# EAGLE design MIDI board (EAGLE 9.0.0)
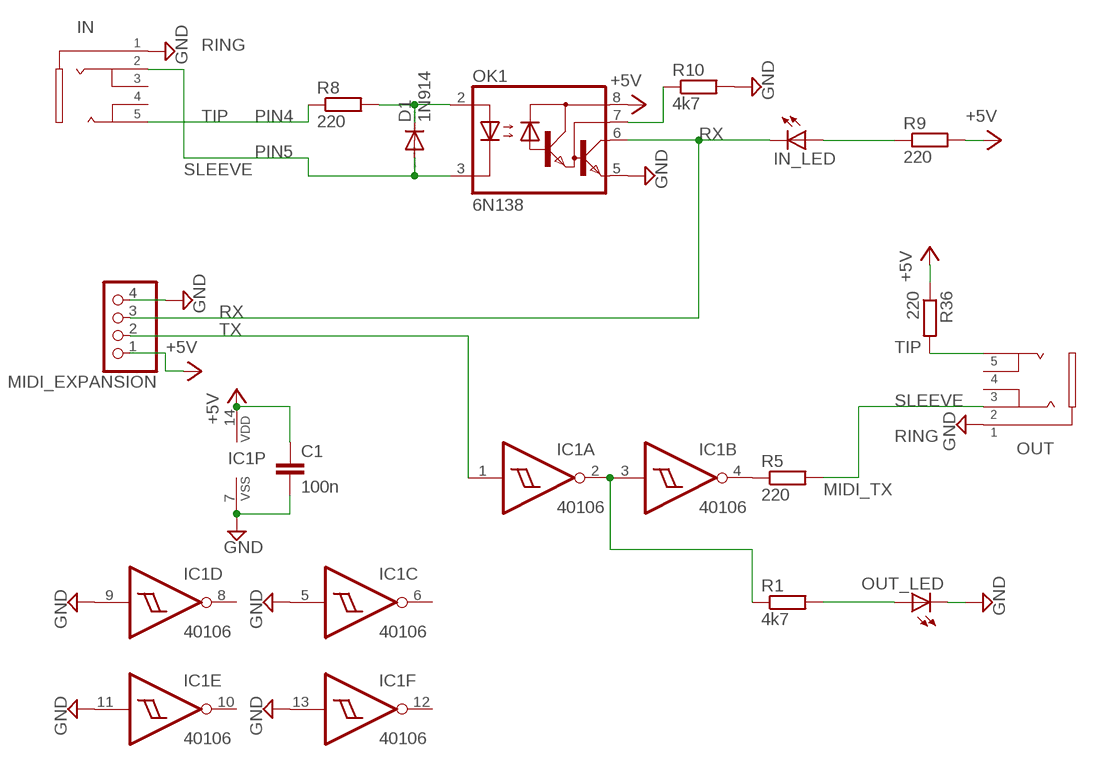
[diagram p0: schematic, sheet 1]

## Parts
C1  100n  C-EU050-025X075  [C050-025X075]
D1  1N914  [D-6.35]
IC1  40106  40106N  [DIL14]
IN  PJ-324MH  [PJ-324MH]
IN_LED  LED3MM-NB  [LED3MM]
MIDI_EXPANSION  PINHD-1X4  [1X04]
OK1  6N138  [DIL08]
OUT  PJ-324MH  [PJ-324MH]
OUT_LED  LED3MM-NB  [LED3MM]
R1  4k7  BOX-RESISTOR  [0204/7]
R5  220  BOX-RESISTOR  [0204/7]
R8  220  BOX-RESISTOR  [0204/7]
R9  220  BOX-RESISTOR  [0204/7]
R10  4k7  BOX-RESISTOR  [0204/7]
R36  220  BOX-RESISTOR  [0204/7]

## Nets
+5V [power]: C1.1 IC1.14(P:VDD) MIDI_EXPANSION.1 OK1.8(VCC) R9.2 R36.1
GND: C1.2 IC1.5(C:I) IC1.7(P:VSS) IC1.9(D:I) IC1.11(E:I) IC1.13(F:I) IN.1 MIDI_EXPANSION.4 OK1.5(GND) OUT.1 OUT_LED.K(C) R10.2
MIDI_TX: OUT.2 R5.2
N$2: OUT_LED.A R1.2
N$16: IN_LED.A R9.1
N$43: IC1.2(A:O) IC1.3(B:I) R1.1
N$44: IC1.4(B:O) R5.1
N$45: OUT.5 R36.2
N$52: OK1.7(VB) R10.1
N$53: D1.C OK1.2(A) R8.2
PIN4: IN.5 R8.1
PIN5: D1.A IN.2 OK1.3(C)
RX: IN_LED.K(C) MIDI_EXPANSION.3 OK1.6(VO)
TX: IC1.1(A:I) MIDI_EXPANSION.2
Unconnected: IC1.6(C:O) IC1.8(D:O) IC1.10(E:O) IC1.12(F:O) IN.3 IN.4 OUT.3 OUT.4

## Notes on the sheet
- RING
- TIP
- SLEEVE
- TIP
- SLEEVE
- RING

## Library data of the parts
C1 = rcl:C-EU: CAPACITOR, European symbol; SPICEPREFIX: C
D1 = toggle-nb:1N914
IC1 = 40xx:40106: Hex SCHMITT TRIGGER
IN OUT = audio-jacks:PJ-324M
IN_LED OUT_LED = toggle-nb:LED3MM-NB
MIDI_EXPANSION = pinhead:PINHD-1X4: PIN HEADER
OK1 = optocoupler:6N138: MOTOROLA OPTO COUPLER; MF: VISHAY/TELEFUNKEN; MPN: 6N138; OC_FARNELL: 9860150; OC_NEWARK: 35K5294
R1 R5 R8-R10 R36 = toggle-nb:BOX-RESISTOR

## Net classes
0 default: width 0.813 mm, clearance 0.152 mm
1 power: width 0.813 mm, clearance 0.152 mm

## Board
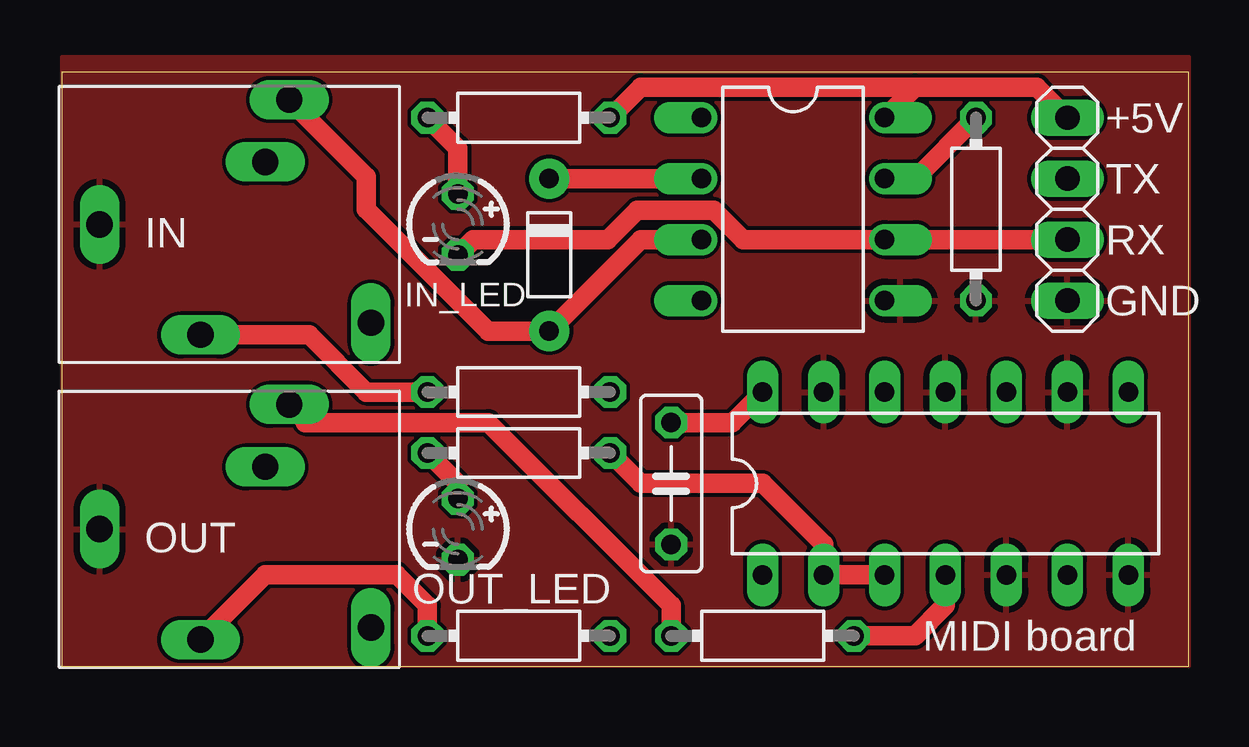
[diagram p1: board, top side]
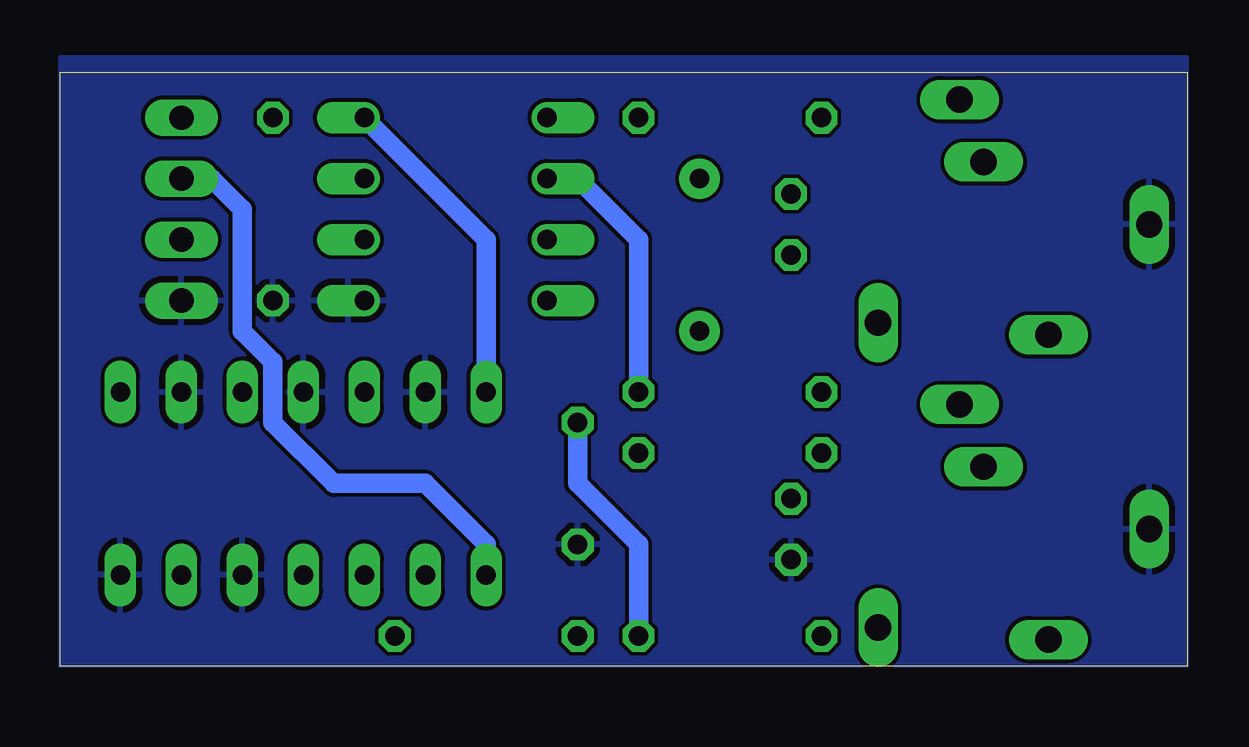
[diagram p2: board, bottom side, seen from below]

Size 46.97 x 24.75 mm. Coordinates in mm from the lower left corner, seen from the top.
Outline: 0,0 46.97,0 46.97,24.75 0,24.75 0,0
Copper layers (1*16): Top 0.035mm / dielectric 1.5mm / Bottom 0.035mm
Design rules "default *": minimum track width 6mil, minimum drill 0.35mm, track to track 6mil, track to pad 6mil, pad to pad 6mil, via to via 6mil, smd to smd 6mil, copper to edge 0mil, drill to drill 6mil, minimum pad ring 10mil, minimum via ring 8mil, stop-mask expansion 4mil, vias tented up to drill 0mil, thermal gap 10mil

### Footprints (pad centres in the part's own frame; a part is rotated, then mirrored left to right if it is on the bottom)
C050-025X075 = drill 0.813 octagon: 1 -2.54,0; 2 2.54,0
D-6.35 = drill 0.813 pad 1.676: A 2.54,0; C -3.81,0
DIL14 = drill 0.813 long: 1 -7.62,-3.81; 2 -5.08,-3.81; 3 -2.54,-3.81; 4 0,-3.81; 5 2.54,-3.81; 6 5.08,-3.81; 7 7.62,-3.81; 8 7.62,3.81; 9 5.08,3.81; 10 2.54,3.81; 11 0,3.81; 12 -2.54,3.81; 13 -5.08,3.81; 14 -7.62,3.81
PJ-324MH = drill 1.1 long: 1 -5.4,0; 2 2.5,5.2; 3 1.5,2.6; 4 5.9,-4.1; 5 -1.2,-4.6
LED3MM = drill 0.813 octagon: A -1.27,0; K 1.27,0
1X04 = drill 1.016 long: 1 -3.81,0; 2 -1.27,0; 3 1.27,0; 4 3.81,0
DIL08 = drill 0.813 offset: 1 -3.81,-3.81; 2 -1.27,-3.81; 3 1.27,-3.81; 4 3.81,-3.81; 5 3.81,3.81; 6 1.27,3.81; 7 -1.27,3.81; 8 -3.81,3.81
0204/7 = drill 0.813 octagon: 1 -3.81,0; 2 3.81,0

### Placement (x,y rotation side)
C1  25.4,7.62 270 top
D1  20.32,16.51 270 top
IC1  36.83,7.62 0 top
IN  6.99,18.41 0 top
IN_LED  16.51,18.41 270 top
MIDI_EXPANSION  41.91,19.05 270 top
OK1  30.48,19.05 270 top
OUT  6.99,5.71 0 top
OUT_LED  16.51,5.71 270 top
R1  19.05,8.89 180 top
R5  29.21,1.27 180 top
R8  19.05,11.43 0 top
R9  19.05,22.86 0 top
R10  38.1,19.05 270 top
R36  19.05,1.27 180 top

### Tracks (layer width: path | path; a pad name or v marks a point on that pad's centre or on a via)
+5V
  Top 0.813: OK1.8 35.56,24.13 | MIDI_EXPANSION.1 40.64,24.13 35.56,24.13 | R9.2 24.13,24.13 35.56,24.13 | C1.1 27.94,10.16 IC1.14
  Bottom 0.813: OK1.8 29.21,17.78 IC1.14 | C1.1 25.4,7.62 22.86,5.08 R36.1
GND
  pour Top: 0,0 0,25.4 46.99,25.4 46.99,0
  pour Bottom: 0,0 0,25.4 46.99,25.4 46.99,0
MIDI_TX
  Top 0.813: OUT.2 10.16,10.24 10.16,10.16 17.78,10.16 25.4,2.54 R5.2
N$2
  Top 0.813: R1.2 16.51,7.62 OUT_LED.A
N$16
  Top 0.813: R9.1 16.51,21.59 IN_LED.A
N$43
  Top 0.813: R1.1 24.13,7.62 29.21,7.62 31.75,5.08 IC1.2 IC1.3
N$44
  Top 0.813: R5.1 35.56,1.27 36.83,2.54 IC1.4
N$45
  Top 0.813: R36.2 15.24,2.54 13.96,3.82 12.31,3.82 12.3,3.81 8.48,3.81 OUT.5
N$52
  Top 0.813: OK1.7 35.56,20.32 R10.1
N$53
  Top 0.813: D1.C OK1.2
  Bottom 0.813: OK1.2 25.4,20.32 22.86,17.78 R8.2
PIN4
  Top 0.813: IN.5 10.31,13.81 12.7,11.43 R8.1
PIN5
  Top 0.813: IN.2 12.7,20.4 12.7,19.05 17.78,13.97 D1.A 24.13,17.78 OK1.3
RX
  Top 0.813: IN_LED.K 17.14,17.78 22.77,17.78 23.98,19 27.18,19 28.39,17.78 OK1.6 MIDI_EXPANSION.3
TX
  Bottom 0.813: IC1.1 29.21,5.08 31.75,7.62 35.56,7.62 38.1,10.16 38.1,12.7 39.37,13.97 39.37,19.05 40.64,20.32 MIDI_EXPANSION.2

### Text on the board
tNames: +5V | TX | RX | GND | MIDI board